# Altium schematic sheet relay_scr.SchDoc
size A4
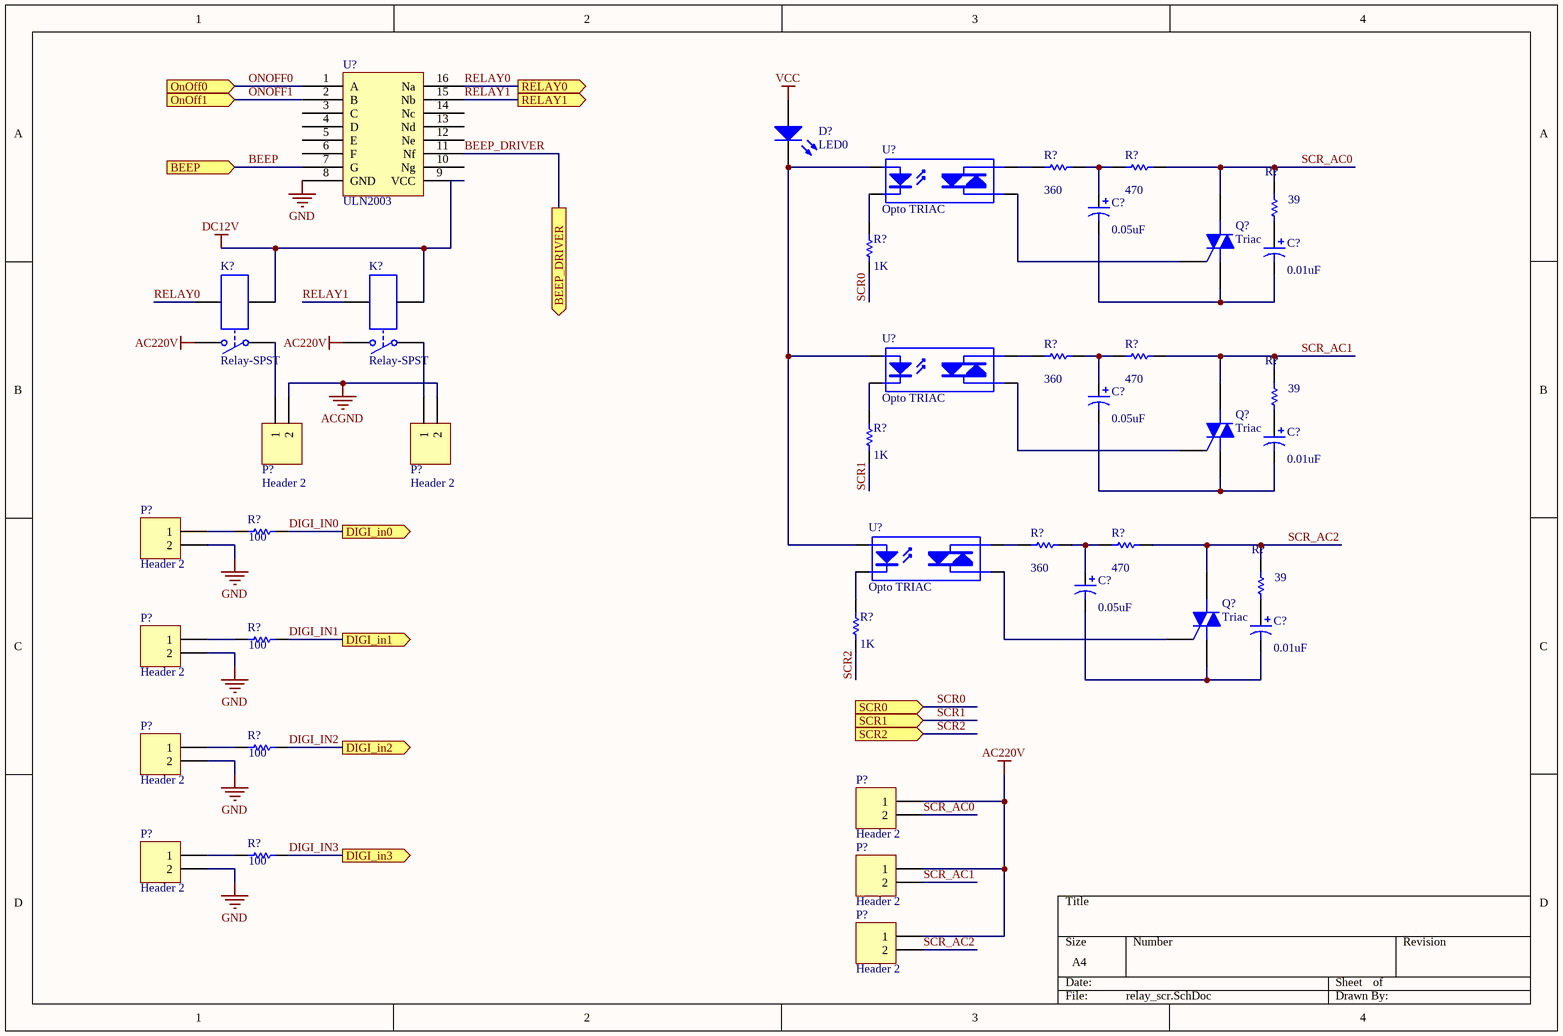
[diagram p0: relay_scr.SchDoc]

## Parts
(Parts that share a designator on the sheet are numbered #1, #2 ... from top to bottom, then left to right.)
C?#1  value 0.05uF  [RB7.6-15]  (hidden comment: Cap Pol1)
C?#2  value 0.01uF  [RB7.6-15]  (hidden comment: Cap Pol1)
C?#3  value 0.05uF  [RB7.6-15]  (hidden comment: Cap Pol1)
C?#4  value 0.01uF  [RB7.6-15]  (hidden comment: Cap Pol1)
C?#5  value 0.05uF  [RB7.6-15]  (hidden comment: Cap Pol1)
C?#6  value 0.01uF  [RB7.6-15]  (hidden comment: Cap Pol1)
D?  LED0  [LED-0]
K?#1  Relay-SPST  [MODULE4]
K?#2  Relay-SPST  [MODULE4]
P?#1  Header 2  [HDR1X2]
P?#2  Header 2  [HDR1X2]
P?#3  Header 2  [HDR1X2]
P?#4  Header 2  [HDR1X2]
P?#5  Header 2  [HDR1X2]
P?#6  Header 2  [HDR1X2]
P?#7  Header 2  [HDR1X2]
P?#8  Header 2  [HDR1X2]
P?#9  Header 2  [HDR1X2]
Q?#1  Triac  [369-03]
Q?#2  Triac  [369-03]
Q?#3  Triac  [369-03]
R?#1  value 360  [AXIAL-0.3]  (hidden comment: Res1)
R?#2  value 470  [AXIAL-0.3]  (hidden comment: Res1)
R?#3  value 39  [AXIAL-0.3]  (hidden comment: Res1)
R?#4  value 1K  [AXIAL-0.3]  (hidden comment: Res1)
R?#5  value 360  [AXIAL-0.3]  (hidden comment: Res1)
R?#6  value 470  [AXIAL-0.3]  (hidden comment: Res1)
R?#7  value 39  [AXIAL-0.3]  (hidden comment: Res1)
R?#8  value 1K  [AXIAL-0.3]  (hidden comment: Res1)
R?#9  value 100  [AXIAL-0.3]  (hidden comment: Res1)
R?#10  value 360  [AXIAL-0.3]  (hidden comment: Res1)
R?#11  value 470  [AXIAL-0.3]  (hidden comment: Res1)
R?#12  value 39  [AXIAL-0.3]  (hidden comment: Res1)
R?#13  value 100  [AXIAL-0.3]  (hidden comment: Res1)
R?#14  value 1K  [AXIAL-0.3]  (hidden comment: Res1)
R?#15  value 100  [AXIAL-0.3]  (hidden comment: Res1)
R?#16  value 100  [AXIAL-0.3]  (hidden comment: Res1)
U?#1  ULN2003
U?#2  Opto TRIAC  [NPSIP4A]
U?#3  Opto TRIAC  [NPSIP4A]
U?#4  Opto TRIAC  [NPSIP4A]

## Ports
BEEP (in), BEEP_DRIVER (out), DIGI_in0 (out), DIGI_in1 (out), DIGI_in2 (out), DIGI_in3 (out), OnOff0 (in), OnOff1 (in), RELAY0 (out), RELAY1 (out), SCR0 (in), SCR1 (in), SCR2 (in)

## Nets
AC220V: K?#1.2 K?#2.2 P?#6.1 P?#8.1 P?#9.1
ACGND: P?#1.2 P?#2.2
DC12V: K?#1.3 K?#2.3 U?#1.9(VCC)
GND: P?#3.2 P?#4.2 P?#5.2 P?#7.2 U?#1.8(GND)
VCC: D?.1(A)
BEEP: U?#1.7(G) ; port BEEP
BEEP_DRIVER: U?#1.11(Nf) ; port BEEP_DRIVER
DIGI_IN0: R?#9.2 ; port DIGI_in0
DIGI_IN1: R?#13.2 ; port DIGI_in1
DIGI_IN2: R?#15.2 ; port DIGI_in2
DIGI_IN3: R?#16.2 ; port DIGI_in3
ONOFF0: U?#1.1(A) ; port OnOff0
ONOFF1: U?#1.2(B) ; port OnOff1
RELAY0: K?#1.4 U?#1.16(Na) ; port RELAY0
RELAY1: K?#2.4 U?#1.15(Nb) ; port RELAY1
SCR0: R?#4.1 ; port SCR0
SCR1: R?#8.1 ; port SCR1
SCR2: R?#14.1 ; port SCR2
SCR_AC0: P?#6.2 Q?#1.2(M2) R?#2.1 R?#3.2
SCR_AC1: P?#8.2 Q?#2.2(M2) R?#6.1 R?#7.2
SCR_AC2: P?#9.2 Q?#3.2(M2) R?#11.1 R?#12.2
NetC?#1_1: C?#1.1 R?#1.1 R?#2.2
NetC?#1_2: C?#1.2 C?#2.2 Q?#1.1(M1)
NetC?#2_1: C?#2.1 R?#3.1
NetC?#3_1: C?#3.1 R?#5.1 R?#6.2
NetC?#3_2: C?#3.2 C?#4.2 Q?#2.1(M1)
NetC?#4_1: C?#4.1 R?#7.1
NetC?#5_1: C?#5.1 R?#10.1 R?#11.2
NetC?#5_2: C?#5.2 C?#6.2 Q?#3.1(M1)
NetC?#6_1: C?#6.1 R?#12.1
NetD?_2: D?.2(K) U?#2.1(A) U?#3.1(A) U?#4.1(A)
NetK?#1_1: K?#1.1 P?#1.1
NetK?#2_1: K?#2.1 P?#2.1
NetP?#3_1: P?#3.1 R?#9.1
NetP?#4_1: P?#4.1 R?#13.1
NetP?#5_1: P?#5.1 R?#15.1
NetP?#7_1: P?#7.1 R?#16.1
NetQ?#1_3: Q?#1.3(G) U?#2.4(A/K)
NetQ?#2_3: Q?#2.3(G) U?#3.4(A/K)
NetQ?#3_3: Q?#3.3(G) U?#4.4(A/K)
NetR?#1_2: R?#1.2 U?#2.3(A/K)
NetR?#4_2: R?#4.2 U?#2.2(K)
NetR?#5_2: R?#5.2 U?#3.3(A/K)
NetR?#8_2: R?#8.2 U?#3.2(K)
NetR?#10_2: R?#10.2 U?#4.3(A/K)
NetR?#14_2: R?#14.2 U?#4.2(K)

Not connected (* = marked no-connect by the designer): U?#1 3(C) 4(D) 5(E) 6(F) 10(Ng) 12(Ne) 13(Nd) 14(Nc)

## Library data of the parts
C?#1-C?#6 = Cap Pol1: Polarized Capacitor (Radial); Published: 8-Jun-2000; LatestRevisionDate: 17-Jul-2002; LatestRevisionNote: Re-released for DXP Platform.; PackageReference: RB7.6-15; Publisher: Altium Limited; PackageDescription: Polarized Capacitor (Radial); 2 Leads
D? = LED0: Typical INFRARED GaAs LED; Published: 8-Jun-2000; LatestRevisionDate: 08-Jul-2005; LatestRevisionNote: Mech Layer 1 removed.; PackageReference: LED-0; Publisher: Altium Limited; PackageDescription: LED; 2 Leads
K?#1 K?#2 = Relay-SPST: Single-Pole Single-Throw Relay; Published: 24-Mar-1999; LatestRevisionDate: 17-Jul-2002; LatestRevisionNote: Re-released for DXP Platform.; PackageReference: MODULE4; Publisher: Altium Limited
P?#1-P?#9 = Header 2: Header, 2-Pin; LatestRevisionDate: 17-Jul-2002; LatestRevisionNote: Re-released for DXP Platform.; Publisher: Altium Limited
Q?#1-Q?#3 = Triac: Silicon Bidirectional Triode Thyristor; Note: Pin 2 is electrically connected to Pin 4 (TAB); Published: 29-Sep-2000; LatestRevisionDate: 17-Jul-2002; LatestRevisionNote: Re-released for DXP Platform.; DatasheetVersion: 1999; PackageReference: 369-03; Publisher: Altium Limited; PackageDescription: TO, Thru-Hole, Vertical, Heatsink Mounted; 3 In-Line Leads; Pitch 2.28 mm; ComponentLink1Description: Manufacturer Link; ComponentLink1URL: http://www.motorola.com/
R?#1-R?#16 = Res1: Resistor; Published: 8-Jun-2000; LatestRevisionDate: 17-Jul-2002; LatestRevisionNote: Re-released for DXP Platform.; PackageReference: AXIAL-0.3; Publisher: Altium Limited; PackageDescription: Axial Device, Thru-Hole; 2 Leads; 0.3 in Pin Spacing
U?#2-U?#4 = Opto TRIAC: Opto-Triac; Published: 24-Mar-1999; LatestRevisionDate: 17-Jul-2002; LatestRevisionNote: Re-released for DXP Platform.; PackageReference: NPSIP4A; Publisher: Altium Limited; PackageDescription: SIP; 4 Leads; Body 10 x 11.5 x 7.5 mm (typ); Pitch 2.54 mm